# EAGLE design WaterLevelIndicator (EAGLE 9.6.2)
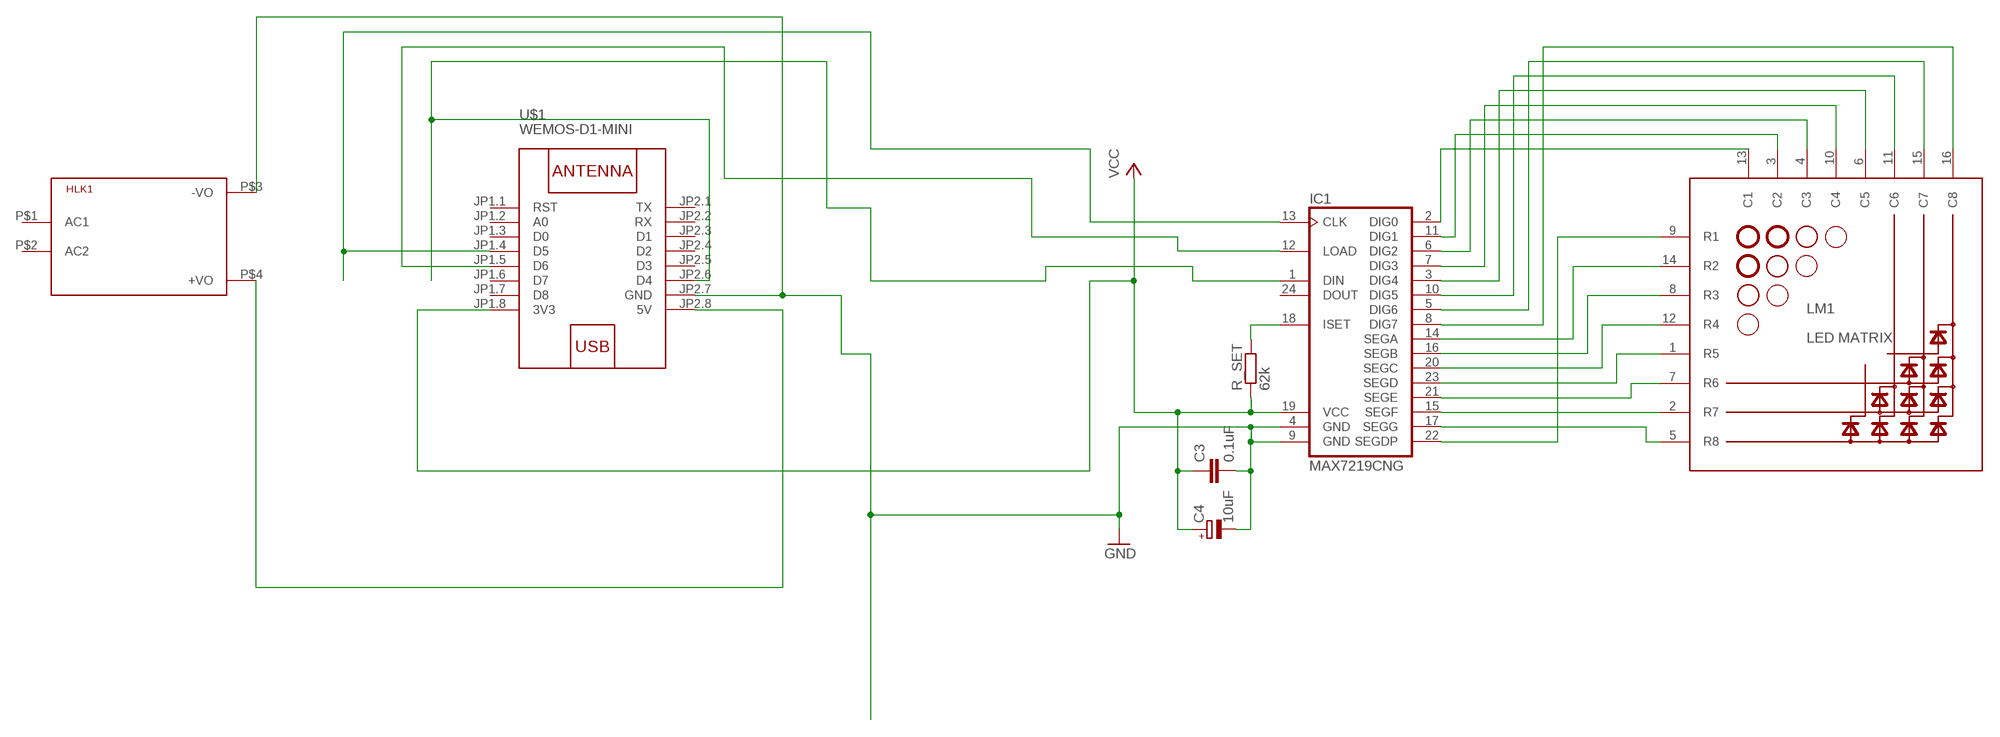
[diagram p0: schematic, sheet 1]

## Parts
C3  0.1uF  C-EU025-024X044  [C025-024X044]
C4  10uF  CPOL-EUE2-5  [E2-5]
HLK1  HLK-PM013W  [HLK-PM01]
IC1  MAX7219CNG  [DIL24-3]
LM1  LED MATRIX  LD-1088BS_LED_MATRIX  [LED_MATRIX]
R_SET  62k  R-EU_0207/10  [0207/10]
U$1  WEMOS-D1-MINI  [WEMOS-D1-MINI]

## Nets
GND: C3.2 C4.- HLK1.P$3(-VO) IC1.4(GND) IC1.9(GND) U$1.JP2.7(GND)
N$2: HLK1.P$4(+VO) U$1.JP2.8(5V)
N$3: IC1.15(SEGF) LM1.2(R7)
N$4: IC1.1(DIN) U$1.JP2.6(D4)
N$5: IC1.12(LOAD) U$1.JP1.5(D6)
N$6: IC1.13(CLK) U$1.JP1.4(D5)
N$8: IC1.21(SEGE) LM1.7(R6)
N$9: IC1.23(SEGD) LM1.1(R5)
N$10: IC1.20(SEGC) LM1.12(R4)
N$11: IC1.16(SEGB) LM1.8(R3)
N$29: IC1.14(SEGA) LM1.14(R2)
N$30: IC1.22(SEGDP) LM1.9(R1)
N$31: IC1.8(DIG7) LM1.16(C8)
N$32: IC1.5(DIG6) LM1.15(C7)
N$33: IC1.10(DIG5) LM1.11(C6)
N$34: IC1.3(DIG4) LM1.6(C5)
N$35: IC1.7(DIG3) LM1.10(C4)
N$36: IC1.6(DIG2) LM1.4(C3)
N$37: IC1.11(DIG1) LM1.3(C2)
N$38: IC1.2(DIG0) LM1.13(C1)
N$43: IC1.18(ISET) R_SET.2
N$44: IC1.17(SEGG) LM1.5(R8)
VCC: C3.1 C4.+ IC1.19(VCC) R_SET.1 U$1.JP1.8(3V3)
Unconnected: HLK1.P$1(AC1) HLK1.P$2(AC2) IC1.24(DOUT) U$1.JP1.1(RST) U$1.JP1.2(A0) U$1.JP1.3(D0) U$1.JP1.6(D7) U$1.JP1.7(D8) U$1.JP2.1(TX) U$1.JP2.2(RX) U$1.JP2.3(D1) U$1.JP2.4(D2) U$1.JP2.5(D3)

## Library data of the parts
C3 = rcl:C-EU: CAPACITOR, European symbol
C4 = rcl:CPOL-EU: POLARIZED CAPACITOR, European symbol
HLK1 = module:HLK-PM01: Hi-Link Power Supply HLK-PM01 3W Author: Ahmed Said <https://github.com/AhmedSaid/EAGLELibraries>
IC1 = maxim:MAX7219CNG: LED DISPLAY DRIVER; MF: MAXIM; MPN: MAX7219CNG; OC_FARNELL: 1523914; OC_NEWARK: 34C4018
LM1 = MajicDesigns:LD-1088BS_LED_MATRIX: 3mm LED Matrix 8x8 Pin 1 side identified by small semicircular plastic piece on lower edge of package.
R_SET = rcl:R-EU_: RESISTOR, European symbol
U$1 = diy-modules:WEMOS-D1-MINI: WEMOS D1 mini: Mini Wi-Fi Board based on ESP-8266 device More details can be found here: https://www.wemos.cc/product/d1-mini.html Click here to find device on ebay.com <http://www.ebay.com/sch/wemos+d1+mini+nodemcu>

## Net classes
1 power: width 0.61 mm, drill 0.66 mm, clearance 0.254 mm

## Board
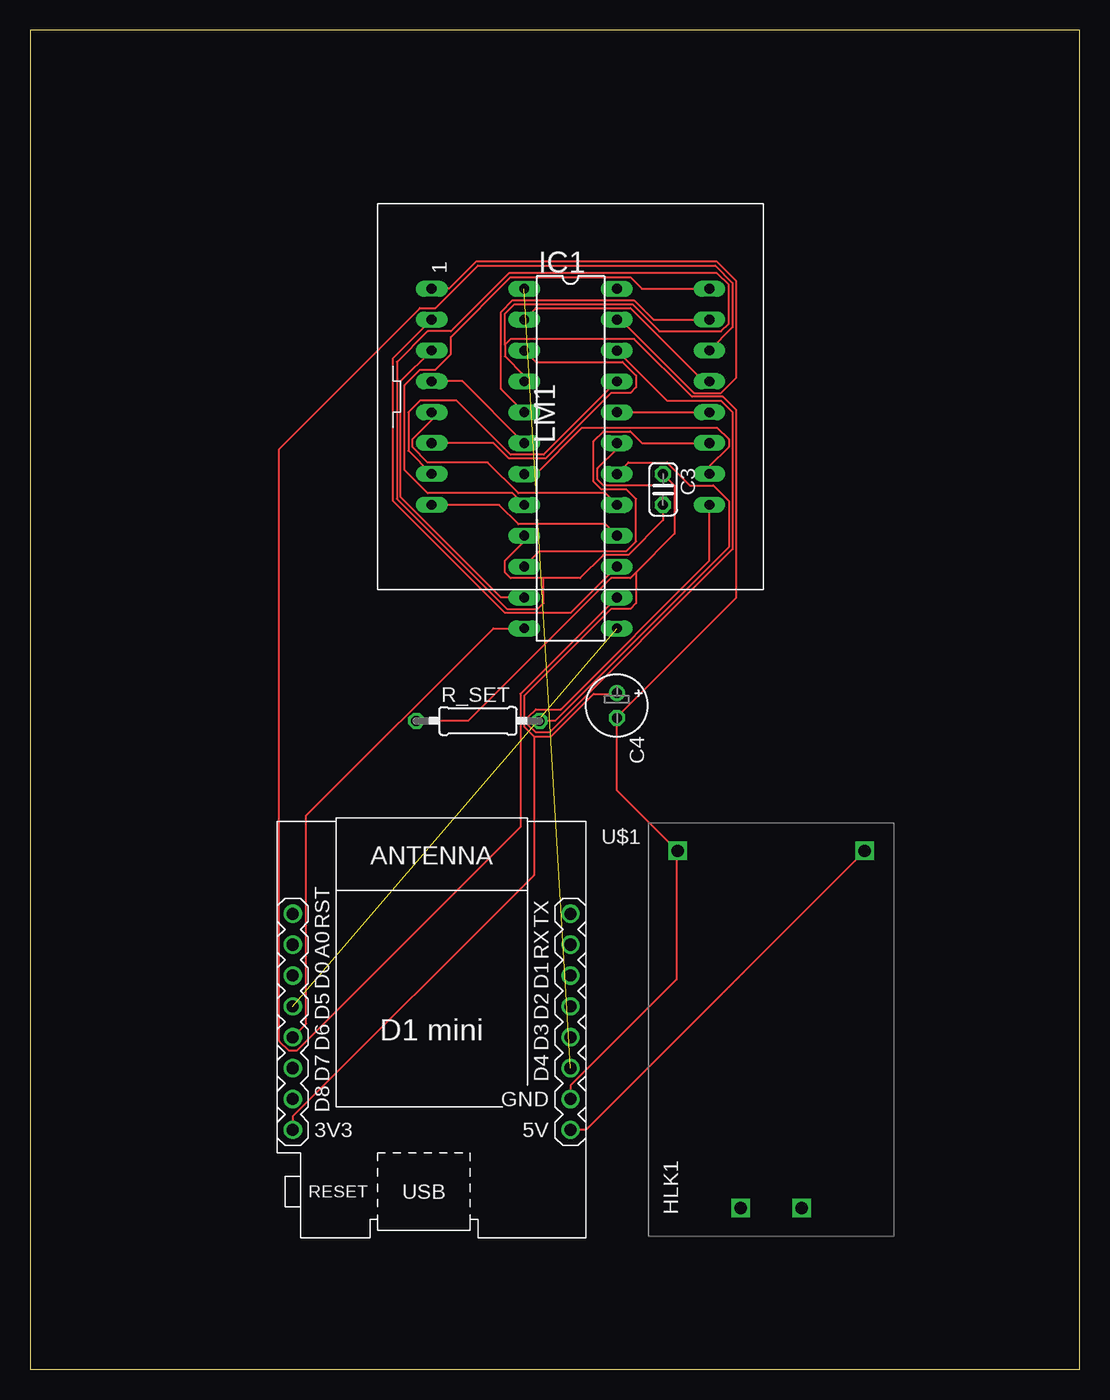
[diagram p1: board, top side]

Size 86.34 x 110.16 mm. Coordinates in mm from the lower left corner, seen from the top.
Outline: 0,0 86.34,0 86.34,110.16 0,110.16 0,0
Copper layers (1*16): Top 0.035mm / dielectric 1.5mm / Bottom 0.035mm
Design rules "default": minimum track width 6mil, minimum drill 0.35mm, track to track 6mil, track to pad 6mil, pad to pad 6mil, via to via 6mil, smd to smd 6mil, copper to edge 40mil, drill to drill 6mil, minimum pad ring 10mil, minimum via ring 8mil, stop-mask expansion 4mil, vias tented up to drill 0mil, thermal gap 10mil

### Footprints (pad centres in the part's own frame; a part is rotated, then mirrored left to right if it is on the bottom)
C025-024X044 = drill 0.813 octagon: 1 -1.27,0; 2 1.27,0
E2-5 = drill 0.813 pad 1.27: + -1.016,0 | drill 0.813 pad 1.27 octagon: - 1.016,0
HLK-PM01 = drill 1.016 square: P$1 -14.7,2.5; P$2 -14.7,-2.5; P$3 14.7,7.7; P$4 14.7,-7.7
DIL24-3 = drill 0.813 long: 1 -13.97,-3.81; 2 -11.43,-3.81; 3 -8.89,-3.81; 4 -6.35,-3.81; 5 -3.81,-3.81; 6 -1.27,-3.81; 7 1.27,-3.81; 8 3.81,-3.81; 9 6.35,-3.81; 10 8.89,-3.81; 11 11.43,-3.81; 12 13.97,-3.81; 13 13.97,3.81; 14 11.43,3.81; 15 8.89,3.81; 16 6.35,3.81; 17 3.81,3.81; 18 1.27,3.81; 19 -1.27,3.81; 20 -3.81,3.81; 21 -6.35,3.81; 22 -8.89,3.81; 23 -11.43,3.81; 24 -13.97,3.81
LED_MATRIX = drill 0.8 long: 1 8.89,11.43; 2 6.35,11.43; 3 3.81,11.43; 4 1.27,11.43; 5 -1.27,11.43; 6 -3.81,11.43; 7 -6.35,11.43; 8 -8.89,11.43; 9 -8.89,-11.43; 10 -6.35,-11.43; 11 -3.81,-11.43; 12 -1.27,-11.43; 13 1.27,-11.43; 14 3.81,-11.43; 15 6.35,-11.43; 16 8.89,-11.43
0207/10 = drill 0.813 octagon: 1 -5.08,0; 2 5.08,0
WEMOS-D1-MINI = drill 1: JP1.1 -11.43,9.525; JP1.2 -11.43,6.985; JP1.3 -11.43,4.445; JP1.4 -11.43,1.905; JP1.5 -11.43,-0.635; JP1.6 -11.43,-3.175; JP1.7 -11.43,-5.715; JP1.8 -11.43,-8.255; JP2.1 11.43,9.525; JP2.2 11.43,6.985; JP2.3 11.43,4.445; JP2.4 11.43,1.905; JP2.5 11.43,-0.635; JP2.6 11.43,-3.175; JP2.7 11.43,-5.715; JP2.8 11.43,-8.255

### Placement (x,y rotation side)
C3  52.07,72.39 270 top
C4  48.26,54.61 270 top
HLK1  60.96,27.94 90 top
IC1  44.45,74.93 270 top
LM1  44.45,80.01 90 top
R_SET  36.83,53.34 0 top
U$1  33.02,27.94 0 top

### Tracks (layer width: path | path; a pad name or v marks a point on that pad's centre or on a via)
GND
  Top 0.152: IC1.9 40.64,68.1 39.05,66.52 39.05,65.56 39.53,65.09 42.23,65.09 | 42.23,65.09 45.24,65.09 47.15,66.99 49.21,66.99 52.07,69.85 C3.2 | IC1.4 40.64,81.76 39.05,83.34 39.05,84.3 | 39.05,84.3 39.53,84.77 49.69,84.77 54.45,80.01 56.99,80.01 58.1,78.9 58.1,63.5 48.26,53.66 C4.- 48.26,47.62 53.18,42.7 HLK1.P$3 53.18,42.55 53.18,32.07 44.45,23.34 U$1.JP2.7 | 42.23,65.09 42.23,63.02 41.75,62.55 39.21,62.55 30.16,71.6 30.16,82.87 32.7,85.41 34.61,85.41 39.37,90.17 56.52,90.17 57.47,89.22 57.47,86.04 56.83,85.41 51.75,85.41 49.53,87.63 39.85,87.63 39.05,86.84 39.05,84.3
N$2
  Top 0.152: U$1.JP2.8 45.72,19.69 68.58,42.55 HLK1.P$4
N$3
  Top 0.152: LM1.2 29.84,83.19 29.84,71.44 39.05,62.23 44.45,62.23 IC1.15
N$4  (1 unrouted)
N$5
  Top 0.152: IC1.12 38.1,60.96 22.7,45.56 22.7,28.42 U$1.JP1.5
N$6  (1 unrouted)
N$8
  Top 0.152: LM1.7 31.12,75.56 31.12,78.74 32.07,79.69 35.08,79.69 39.53,75.25 42.23,75.25 IC1.21
N$9
  Top 0.152: LM1.1 34.45,88.9 36.67,91.12 56.52,91.12 58.1,89.53 58.1,81.6 56.83,80.33 54.61,80.33 48.58,86.36 IC1.23
N$10
  Top 0.152: IC1.20 LM1.12
N$11
  Top 0.152: LM1.8 38.58,71.12 40.16,69.53 47.31,69.53 IC1.16
N$29
  Top 0.152: LM1.14 57.79,85.73 57.79,89.38 56.36,90.81 36.83,90.81 33.34,87.31 32.07,87.31 20.48,75.72 20.48,26.99 21.27,26.19 21.91,26.19 40.32,44.61 40.32,55.56 IC1.14
N$30
  Top 0.152: LM1.9 55.88,66.52 43.66,54.29 41.59,54.29 40.96,53.66 40.96,53.02 41.59,52.39 42.7,52.39 57.79,67.47 57.79,78.74 56.83,79.69 52.39,79.69 IC1.22
N$31
  Top 0.152: LM1.16 50.32,88.9 49.37,89.85 39.53,89.85 34.61,84.93 34.61,83.5 33.34,82.23 32.07,82.23 30.8,80.96 30.8,73.98 32.7,72.07 39.69,72.07 IC1.8
N$32
  Top 0.152: LM1.15 51.28,86.36 49.69,87.95 39.69,87.95 38.73,87 38.73,80.64 IC1.5
N$33
  Top 0.152: LM1.11 50.32,76.2 49.37,77.15 47.15,77.15 46.36,76.36 46.36,73.03 46.99,72.39 49.05,72.39 49.85,71.6 49.85,68.1 49.05,67.31 41.91,67.31 IC1.10
N$34
  Top 0.152: LM1.6 38.1,76.2 39.37,74.93 42.39,74.93 47.78,80.33 49.37,80.33 49.85,80.8 49.85,81.76 48.74,82.87 41.59,82.87 IC1.3
N$35
  Top 0.152: LM1.10 55.88,74.3 57.47,75.88 57.47,76.52 56.52,77.47 45.4,77.47 41.59,73.66 IC1.7
N$36
  Top 0.152: LM1.4 35.56,81.28 IC1.6
N$37
  Top 0.152: LM1.3 30.48,81.28 30.48,71.75 38.73,63.5 IC1.11
N$38
  Top 0.152: LM1.13 55.4,81.28 49.37,87.31 41.59,87.31 IC1.2
N$43
  Top 0.152: R_SET.2 43.18,53.34 57.47,67.63 57.47,71.44 56.2,72.71 54.29,72.71 52.39,74.61 49.21,74.61 IC1.18
N$44
  Top 0.152: LM1.5 33.02,78.11 31.43,76.52 31.43,75.88 32.7,74.61 37.62,74.61 40.16,72.07 47.31,72.07 IC1.17
VCC
  Top 0.152: R_SET.1 36.04,53.34 47.78,65.09 49.37,65.09 49.85,65.56 | 49.85,65.56 53.02,68.74 53.02,72.71 | C3.1 53.02,72.71 | 41.43,52.07 42.86,52.07 46.36,55.56 48.26,55.56 C4.+ | 41.43,52.07 40.64,52.86 40.64,55.4 47.78,62.55 49.37,62.55 49.85,63.02 49.85,65.56 | IC1.19 48.26,75.72 46.67,74.14 46.67,73.18 47.15,72.71 53.02,72.71 | U$1.JP1.8 21.59,20.8 41.43,40.64 41.43,52.07